# Altium schematic sheet 06_SOM_CAM.SchDoc
size 420 x 297 mm; SheetNumber: 12; SheetTotal: 28
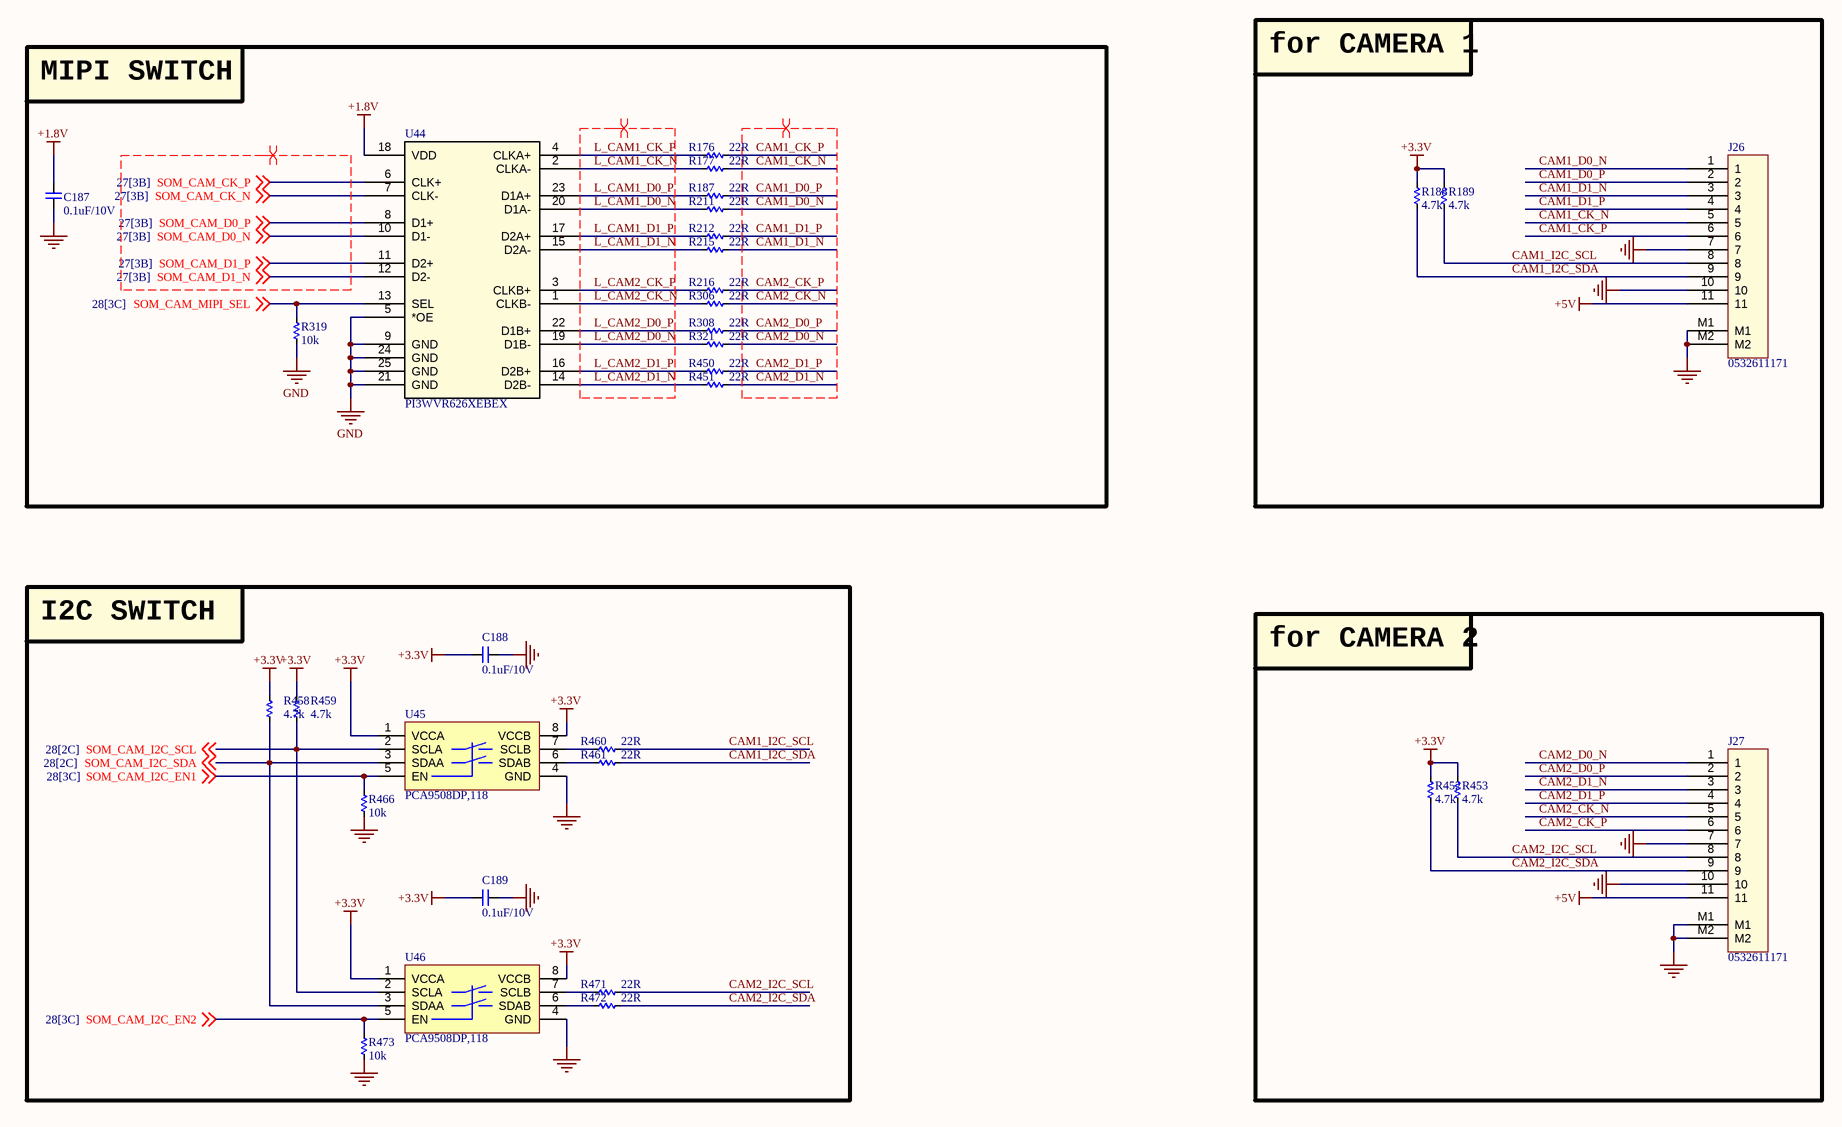
[diagram p0: 06_SOM_CAM.SchDoc]

## Parts
C187  0.1uF/10V  [CAP_C_1005X60]
C188  0.1uF/10V  [CAP_C_1005X60]
C189  0.1uF/10V  [CAP_C_1005X60]
J26  0532611171  [MOLEX_0532611171]
J27  0532611171  [MOLEX_0532611171]
R176  22R  [RES_C_1005X40]
R177  22R  [RES_C_1005X40]
R187  22R  [RES_C_1005X40]
R188  4.7k  [RES_C_1005X40]
R189  4.7k  [RES_C_1005X40]
R211  22R  [RES_C_1005X40]
R212  22R  [RES_C_1005X40]
R215  22R  [RES_C_1005X40]
R216  22R  [RES_C_1005X40]
R306  22R  [RES_C_1005X40]
R308  22R  [RES_C_1005X40]
R319  10k  [RES_C_1005X40]
R321  22R  [RES_C_1005X40]
R450  22R  [RES_C_1005X40]
R451  22R  [RES_C_1005X40]
R452  4.7k  [RES_C_1005X40]
R453  4.7k  [RES_C_1005X40]
R458  4.7k  [RES_C_1005X40]
R459  4.7k  [RES_C_1005X40]
R460  22R  [RES_C_1005X40]
R461  22R  [RES_C_1005X40]
R466  10k  [RES_C_1005X40]
R471  22R  [RES_C_1005X40]
R472  22R  [RES_C_1005X40]
R473  10k  [RES_C_1005X40]
U44  PI3WVR626XEBEX  [PI3WVR626XEBEX_DIO]
U45  PCA9508DP,118  [TSOP8]
U46  PCA9508DP,118  [TSOP8]

## Blocks framed on the sheet
MIPI SWITCH: C187 R176 R177 R187 R211 R212 R215 R216 R306 R308 R319 R321 R450 R451 U44
for CAMERA 1: J26 R188 R189
I2C SWITCH: C188 C189 R458-R461 R466 R471-R473 U45 U46
for CAMERA 2: J27 R452 R453

## Nets
+1.8V: C187.2 U44.18(VDD)
+3.3V: C188.2 C189.2 R188.1 R189.1 R452.1 R453.1 R458.1 R459.1 U45.1(VCCA) U45.8(VCCB) U46.1(VCCA) U46.8(VCCB)
+5V: J26.11 J27.11
GND: C187.1 C188.1 C189.1 J26.7 J26.10 J26.M1 J26.M2 J27.7 J27.10 J27.M1 J27.M2 R319.1 R466.2 R473.2 U44.5(*OE) U44.9(GND) U44.21(GND) U44.24(GND) U44.25(GND) U45.4(GND) U46.4(GND)
CAM1_CK_N: J26.5 R177.2
CAM1_CK_P: J26.6 R176.2
CAM1_D0_N: J26.1 R211.2
CAM1_D0_P: J26.2 R187.2
CAM1_D1_N: J26.3 R215.2
CAM1_D1_P: J26.4 R212.2
CAM1_I2C_SCL: J26.8 R189.2 R460.2
CAM1_I2C_SDA: J26.9 R188.2 R461.2
CAM2_CK_N: J27.5 R306.2
CAM2_CK_P: J27.6 R216.2
CAM2_D0_N: J27.1 R321.2
CAM2_D0_P: J27.2 R308.2
CAM2_D1_N: J27.3 R451.2
CAM2_D1_P: J27.4 R450.2
CAM2_I2C_SCL: J27.8 R453.2 R471.2
CAM2_I2C_SDA: J27.9 R452.2 R472.2
L_CAM1_CK_N: R177.1 U44.2(CLKA-)
L_CAM1_CK_P: R176.1 U44.4(CLKA+)
L_CAM1_D0_N: R211.1 U44.20(D1A-)
L_CAM1_D0_P: R187.1 U44.23(D1A+)
L_CAM1_D1_N: R215.1 U44.15(D2A-)
L_CAM1_D1_P: R212.1 U44.17(D2A+)
L_CAM2_CK_N: R306.1 U44.1(CLKB-)
L_CAM2_CK_P: R216.1 U44.3(CLKB+)
L_CAM2_D0_N: R321.1 U44.19(D1B-)
L_CAM2_D0_P: R308.1 U44.22(D1B+)
L_CAM2_D1_N: R451.1 U44.14(D2B-)
L_CAM2_D1_P: R450.1 U44.16(D2B+)
SOM_CAM_CK_N: U44.7(CLK-) ; off-sheet SOM_CAM_CK_N
SOM_CAM_CK_P: U44.6(CLK+) ; off-sheet SOM_CAM_CK_P
SOM_CAM_D0_N: U44.10(D1-) ; off-sheet SOM_CAM_D0_N
SOM_CAM_D0_P: U44.8(D1+) ; off-sheet SOM_CAM_D0_P
SOM_CAM_D1_N: U44.12(D2-) ; off-sheet SOM_CAM_D1_N
SOM_CAM_D1_P: U44.11(D2+) ; off-sheet SOM_CAM_D1_P
SOM_CAM_I2C_EN1: R466.1 U45.5(EN) ; off-sheet SOM_CAM_I2C_EN1
SOM_CAM_I2C_EN2: R473.1 U46.5(EN) ; off-sheet SOM_CAM_I2C_EN2
SOM_CAM_I2C_SCL: R459.2 U45.2(SCLA) U46.2(SCLA) ; off-sheet SOM_CAM_I2C_SCL
SOM_CAM_I2C_SDA: R458.2 U45.3(SDAA) U46.3(SDAA) ; off-sheet SOM_CAM_I2C_SDA
SOM_CAM_MIPI_SEL: R319.2 U44.13(SEL) ; off-sheet SOM_CAM_MIPI_SEL
NetR460_1: R460.1 U45.7(SCLB)
NetR461_1: R461.1 U45.6(SDAB)
NetR471_1: R471.1 U46.7(SCLB)
NetR472_1: R472.1 U46.6(SDAB)

## Layout directives
differential pair; net class DIFF100; differential pair class DIFF100: CAM1_CK_N, CAM1_CK_P, CAM1_D0_N, CAM1_D0_P, CAM1_D1_N, CAM1_D1_P, CAM2_CK_N, CAM2_CK_P, CAM2_D0_N, CAM2_D0_P, CAM2_D1_N, CAM2_D1_P, L_CAM1_CK_N, L_CAM1_CK_P, L_CAM1_D0_N, L_CAM1_D0_P, L_CAM1_D1_N, L_CAM1_D1_P, L_CAM2_CK_N, L_CAM2_CK_P, L_CAM2_D0_N, L_CAM2_D0_P, L_CAM2_D1_N, L_CAM2_D1_P, SOM_CAM_CK_N, SOM_CAM_CK_P, SOM_CAM_D0_N, SOM_CAM_D0_P, SOM_CAM_D1_N, SOM_CAM_D1_P

## Notes on the sheet
- Project:
- Sub-system:
- Design by:
- Sheet title:
- Sheet
- of
- Checked by:
- Approved by:
- Revision:
- Document No:
- Size:
- Date:
- A3

## Library data of the parts
C187-C189 = _CAP_C_2: CAP CHIP
J26 J27 = Header 11x1_2M
R176 R177 R187-R189 R211 R212 R215 R216 R306 R308 R319 R321 R450-R453 R458-R461 R466 R471-R473 = _RES_B_2: RES
U44 = PI3WVR626XEBEX: Mfr_Name: Diodes Inc; RefDes: RefDes; Type: Type